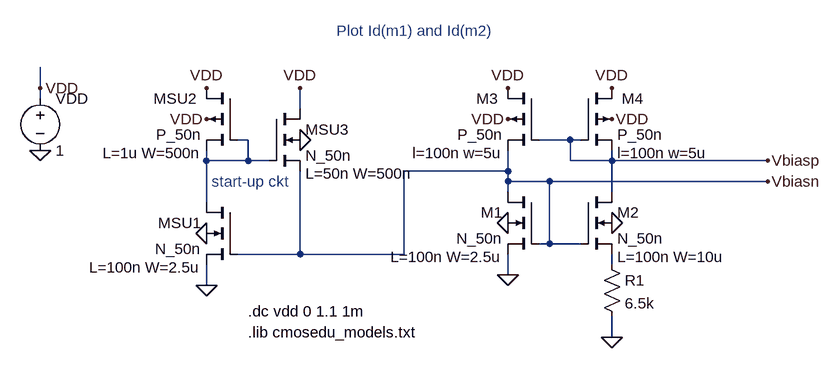
[diagram p0: schematic Fig20_18.asc]
Fig20_18.asc, the LTspice schematic file:
Version 4
SHEET 1 1508 680
WIRE 288 -96 288 -128
WIRE 288 -80 288 -96
WIRE 544 16 544 0
WIRE 544 80 544 16
WIRE 544 208 544 176
WIRE 608 -16 592 -16
WIRE 608 16 544 16
WIRE 608 16 608 -16
WIRE 640 16 608 16
WIRE 688 -64 688 -96
WIRE 688 160 592 160
WIRE 688 160 688 32
WIRE 848 160 688 160
WIRE 848 160 848 32
WIRE 1008 32 848 32
WIRE 1008 32 1008 0
WIRE 1008 48 1008 32
WIRE 1008 64 1008 48
WIRE 1008 192 1008 160
WIRE 1072 48 1008 48
WIRE 1072 144 1056 144
WIRE 1072 144 1072 48
WIRE 1104 -16 1056 -16
WIRE 1104 16 1104 -16
WIRE 1120 -16 1104 -16
WIRE 1120 144 1072 144
WIRE 1168 16 1104 16
WIRE 1168 16 1168 0
WIRE 1168 64 1168 16
WIRE 1168 176 1168 160
WIRE 1168 288 1168 256
WIRE 1408 16 1168 16
WIRE 1408 48 1072 48
FLAG 288 0 0
FLAG 288 -96 VDD
FLAG 544 -48 VDD
FLAG 544 -96 VDD
FLAG 544 208 0
FLAG 544 128 0
FLAG 688 -16 0
FLAG 688 -96 VDD
FLAG 1008 -48 VDD
FLAG 1008 -96 VDD
FLAG 1168 -48 VDD
FLAG 1168 -96 VDD
FLAG 1408 16 Vbiasp
FLAG 1008 192 0
FLAG 1008 112 0
FLAG 1168 288 0
FLAG 1168 112 0
FLAG 1408 48 Vbiasn
SYMBOL voltage 288 -96 R0
WINDOW 123 0 0 Left 0
WINDOW 39 0 0 Left 0
SYMATTR InstName VDD
SYMATTR Value 1
SYMBOL pmos4 592 -96 M0
WINDOW 0 63 16 Left 0
WINDOW 123 56 100 Left 0
SYMATTR InstName MSU2
SYMATTR Value2 L=1u W=500n
SYMATTR Value P_50n
SYMBOL nmos4 592 80 M0
WINDOW 123 56 100 Left 0
SYMATTR Value2 L=100n W=2.5u
SYMATTR InstName MSU1
SYMATTR Value N_50n
SYMBOL nmos4 640 -64 R0
WINDOW 123 56 100 Left 0
SYMATTR Value2 L=50n W=500n
SYMATTR InstName MSU3
SYMATTR Value N_50n
SYMBOL pmos4 1056 -96 M0
WINDOW 0 63 16 Left 0
WINDOW 123 56 100 Left 0
SYMATTR InstName M3
SYMATTR Value2 l=100n w=5u
SYMATTR Value P_50n
SYMBOL pmos4 1120 -96 R0
WINDOW 0 63 16 Left 0
WINDOW 123 56 100 Left 0
SYMATTR InstName M4
SYMATTR Value2 l=100n w=5u
SYMATTR Value P_50n
SYMBOL nmos4 1056 64 M0
WINDOW 123 56 100 Left 0
SYMATTR Value2 L=100n W=2.5u
SYMATTR InstName M1
SYMATTR Value N_50n
SYMBOL nmos4 1120 64 R0
WINDOW 123 56 100 Left 0
SYMATTR Value2 L=100n W=10u
SYMATTR InstName M2
SYMATTR Value N_50n
SYMBOL res 1152 160 R0
SYMATTR InstName R1
SYMATTR Value 6.5k
TEXT 608 280 Left 0 !.lib cmosedu_models.txt
TEXT 608 248 Left 0 !.dc vdd 0 1.1 1m
TEXT 552 48 Left 0 ;start-up ckt
TEXT 744 -184 Left 0 ;Plot Id(m1) and Id(m2)

The netlist it stands for:
* Fig20_18.asc
VDD VDD 0 1
MSU2 VDD N001 N001 VDD P_50n L=1u W=500n
MSU1 N001 Vbiasn 0 0 N_50n L=100n W=2.5u
MSU3 VDD N001 Vbiasn 0 N_50n L=50n W=500n
M3 VDD Vbiasp Vbiasn VDD P_50n l=100n w=5u
M4 VDD Vbiasp Vbiasp VDD P_50n l=100n w=5u
M1 Vbiasn Vbiasn 0 0 N_50n L=100n W=2.5u
M2 Vbiasp Vbiasn N002 0 N_50n L=100n W=10u
R1 N002 0 6.5k
.model NMOS NMOS
.model PMOS PMOS
.lib standard.mos
.lib cmosedu_models.txt
.dc vdd 0 1.1 1m
* start-up ckt
* Plot Id(m1) and Id(m2)
.backanno
.end